# EAGLE design Prototype (EAGLE 6.5.0)
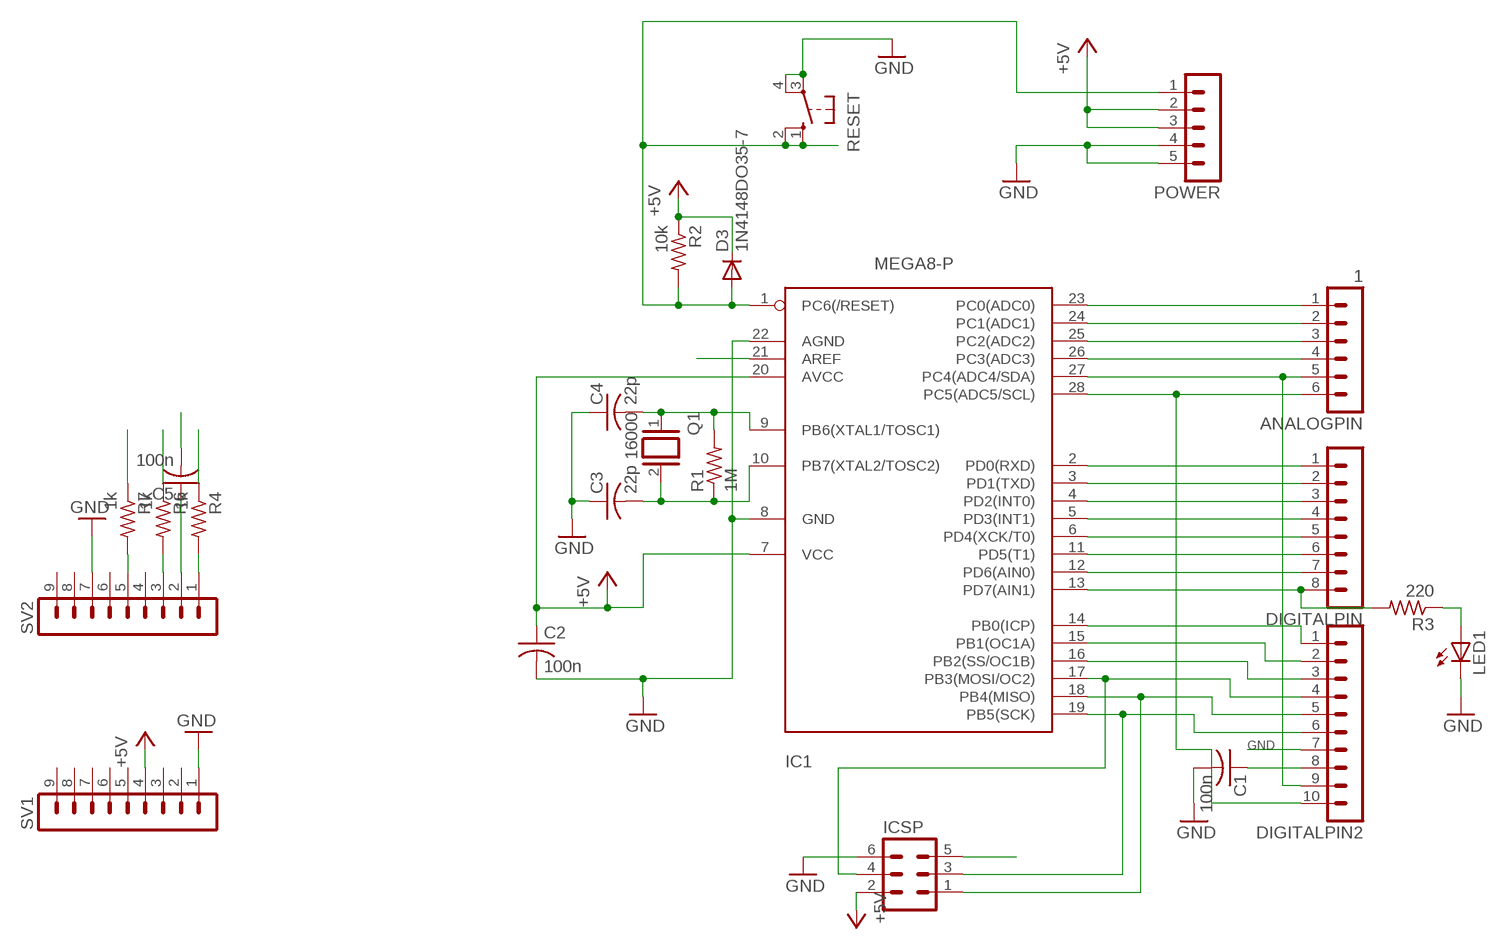
[diagram p0: schematic, sheet 1]

## Parts
ANALOGPIN  1  MA06-1  [MA06-1]
C1  100n  C-US025-024X044  [C025-024X044]
C2  100n  C-US025-024X044  [C025-024X044]
C3  22p  C-US025-024X044  [C025-024X044]
C4  22p  C-US025-024X044  [C025-024X044]
C5  100n  C-US025-024X044  [C025-024X044]
D3  1N4148DO35-7  [DO35-7]
DIGITALPIN  MA08-1  [MA08-1]
DIGITALPIN2  MA10-1  [MA10-1]
IC1  MEGA8-P  [DIL28-3]
ICSP  MA03-2  [MA03-2]
LED1  LED3MM  [LED3MM]
POWER  MA05-1  [MA05-1]
Q1  16000  XTAL/S  [QS]
R1  1M  R-US_0204/7  [0204/7]
R2  10k  R-US_0204/7  [0204/7]
R3  220  R-US_0204/7  [0204/7]
R4  1k  R-US_0204/7  [0204/7]
R6  1k  R-US_0204/7  [0204/7]
R7  1k  R-US_0204/7  [0204/7]
RESET  10-XX  [B3F-10XX]
SV1  MA09-1  [MA09-1]
SV2  MA09-1  [MA09-1]

## Nets
+5V: C2.1 D3.C IC1.7(VCC) IC1.20(AVCC) ICSP.2 POWER.2 POWER.3 R2.1 SV1.4
AREF: C1.1 DIGITALPIN2.8 IC1.21(AREF)
GND: C1.2 C2.2 C3.1 C4.1 DIGITALPIN2.7 IC1.8(GND) IC1.22(AGND) ICSP.6 LED1.K(C) POWER.4 POWER.5 RESET.3(P) RESET.4(P1) SV1.1 SV2.7
N$1: C4.2 IC1.9(PB6(XTAL1/TOSC1)) Q1.1 R1.2
N$2: C3.2 IC1.10(PB7(XTAL2/TOSC2)) Q1.2 R1.1
N$3: LED1.A R3.1
N$4: C5.1 SV2.2
N$5: R7.2 SV2.5
N$6: DIGITALPIN.3 IC1.4(PD2(INT0))
N$7: DIGITALPIN.4 IC1.5(PD3(INT1))
N$8: DIGITALPIN.5 IC1.6(PD4(XCK/T0))
N$9: DIGITALPIN.6 IC1.11(PD5(T1))
N$10: DIGITALPIN.7 IC1.12(PD6(AIN0))
N$11: DIGITALPIN.8 IC1.13(PD7(AIN1)) R3.2
N$12: ANALOGPIN.1 IC1.23(PC0(ADC0))
N$13: ANALOGPIN.2 IC1.24(PC1(ADC1))
N$14: ANALOGPIN.3 IC1.25(PC2(ADC2))
N$15: ANALOGPIN.4 IC1.26(PC3(ADC3))
N$16: ANALOGPIN.5 DIGITALPIN2.9 IC1.27(PC4(ADC4/SDA))
N$17: R4.2 SV2.1
N$18: DIGITALPIN2.1 IC1.14(PB0(ICP))
N$19: DIGITALPIN2.2 IC1.15(PB1(OC1A))
N$20: DIGITALPIN2.3 IC1.16(PB2(SS/OC1B))
N$22: DIGITALPIN2.5 IC1.18(PB4(MISO)) ICSP.1
N$23: DIGITALPIN2.6 IC1.19(PB5(SCK)) ICSP.3
N$24: R6.2 SV2.3
N$25: DIGITALPIN2.4 IC1.17(PB3(MOSI/OC2)) ICSP.4
N$27: ANALOGPIN.6 DIGITALPIN2.10 IC1.28(PC5(ADC5/SCL))
RES1: C5.2 D3.A IC1.1(PC6(/RESET)) ICSP.5 POWER.1 R2.2 R6.1 RESET.1(S) RESET.2(S1)
RXD: DIGITALPIN.1 IC1.2(PD0(RXD)) R7.1
TXD: DIGITALPIN.2 IC1.3(PD1(TXD)) R4.1
Unconnected: SV1.2 SV1.3 SV1.5 SV1.6 SV1.7 SV1.8 SV1.9 SV2.4 SV2.6 SV2.8 SV2.9

## Library data of the parts
ANALOGPIN = con-lstb:MA06-1: PIN HEADER
C1-C5 = rcl:C-US: CAPACITOR, American symbol
D3 = diode:1N4148: DIODE high speed (Philips)
DIGITALPIN = con-lstb:MA08-1: PIN HEADER
DIGITALPIN2 = con-lstb:MA10-1: PIN HEADER
IC1 = atmel:MEGA8-P: MICROCONTROLLER 8 Kbytes FLASH, 1 kbytes SRAM, 512 bytes EEPROM, USART, 4-channel 10 bit ADC, 2-channel 8 bit ADC Pin compatible with Atmega48, ATMega88, ATMega168 Source: avr.lbr
ICSP = con-lstb:MA03-2: PIN HEADER
LED1 = led:LED: LED OSRAM: - CHIPLED LG R971, LG N971, LY N971, LG Q971, LY Q971, LO R971, LY R971 LH N974, LH R974 LS Q976, LO Q976, LY Q976 LO Q996 - Hyper CHIPLED LW Q18S LB Q993, LB Q99A, LB R99A - SideLED LS A670, LO A670, LY A670, LG A670, LP A670 LB A673, LV A673, LT A673, LW A673 LH A674 LY A675 LS A676, LA A676, LO A676, LY A676, LW A676 LS A679, LY A679, LG A679 - Hyper Micro SIDELED® LS Y876, LA Y876, LO Y876, LY Y876 LT Y87S - SmartLED LW L88C, LW L88S LB L89C, LB L89S, LG L890 LS L89K, LO L89K, LY L89K LS L896, LA L896, LO L896, LY L896 - TOPLED LS T670, LO T670, LY T670, LG T670, LP T670 LSG T670, LSP T670, LSY T670, LOP T670, LYG T670 LG T671, LOG T671, LSG T671 LB T673, LV T673, LT T673, LW T673 LH T674 LS T676, LA T676, LO T676, LY T676, LB T676, LH T676, LSB T676, LW T676 LB T67C, LV T67C, LT T67C, LS T67K, LO T67K, LY T67K, LW E67C LS E67B, LA E67B, LO E67B, LY E67B, LB E67C, LV E67C, LT E67C LW T67C LS T679, LY T679, LG T679 LS T770, LO T770, LY T770, LG T770, LP T770 LB T773, LV T773, LT T773, LW T773 LH T774 LS E675, LA E675, LY E675, LS T675 LS T776, LA T776, LO T776, LY T776, LB T776 LHGB T686 LT T68C, LB T68C - Hyper Mini TOPLED® LB M676 - Mini TOPLED Santana® LG M470 LS M47K, LO M47K, LY M47K Source: http://www.osram.convergy.de LUXEON: - LUMILED® LXK2-PW12-R00, LXK2-PW12-S00, LXK2-PW14-U00, LXK2-PW14-V00 LXK2-PM12-R00, LXK2-PM12-S00, LXK2-PM14-U00 LXK2-PE12-Q00, LXK2-PE12-R00, LXK2-PE12-S00, LXK2-PE14-T00, LXK2-PE14-U00 LXK2-PB12-K00, LXK2-PB12-L00, LXK2-PB12-M00, LXK2-PB14-N00, LXK2-PB14-P00, LXK2-PB14-Q00 LXK2-PR12-L00, LXK2-PR12-M00, LXK2-PR14-Q00, LXK2-PR14-R00 LXK2-PD12-Q00, LXK2-PD12-R00, LXK2-PD12-S00 LXK2-PH12-R00, LXK2-PH12-S00 LXK2-PL12-P00, LXK2-PL12-Q00, LXK2-PL12-R00 Source: www.luxeon.com KINGBRIGHT: KA-3528ASYC Source: www.kingbright.com
POWER = con-lstb:MA05-1: PIN HEADER
Q1 = special:XTAL/S: CRYSTAL
R1-R4 R6 R7 = rcl:R-US_: RESISTOR, American symbol
RESET = switch-omron:10-XX: OMRON SWITCH
SV1 SV2 = con-lstb:MA09-1: PIN HEADER

## Board
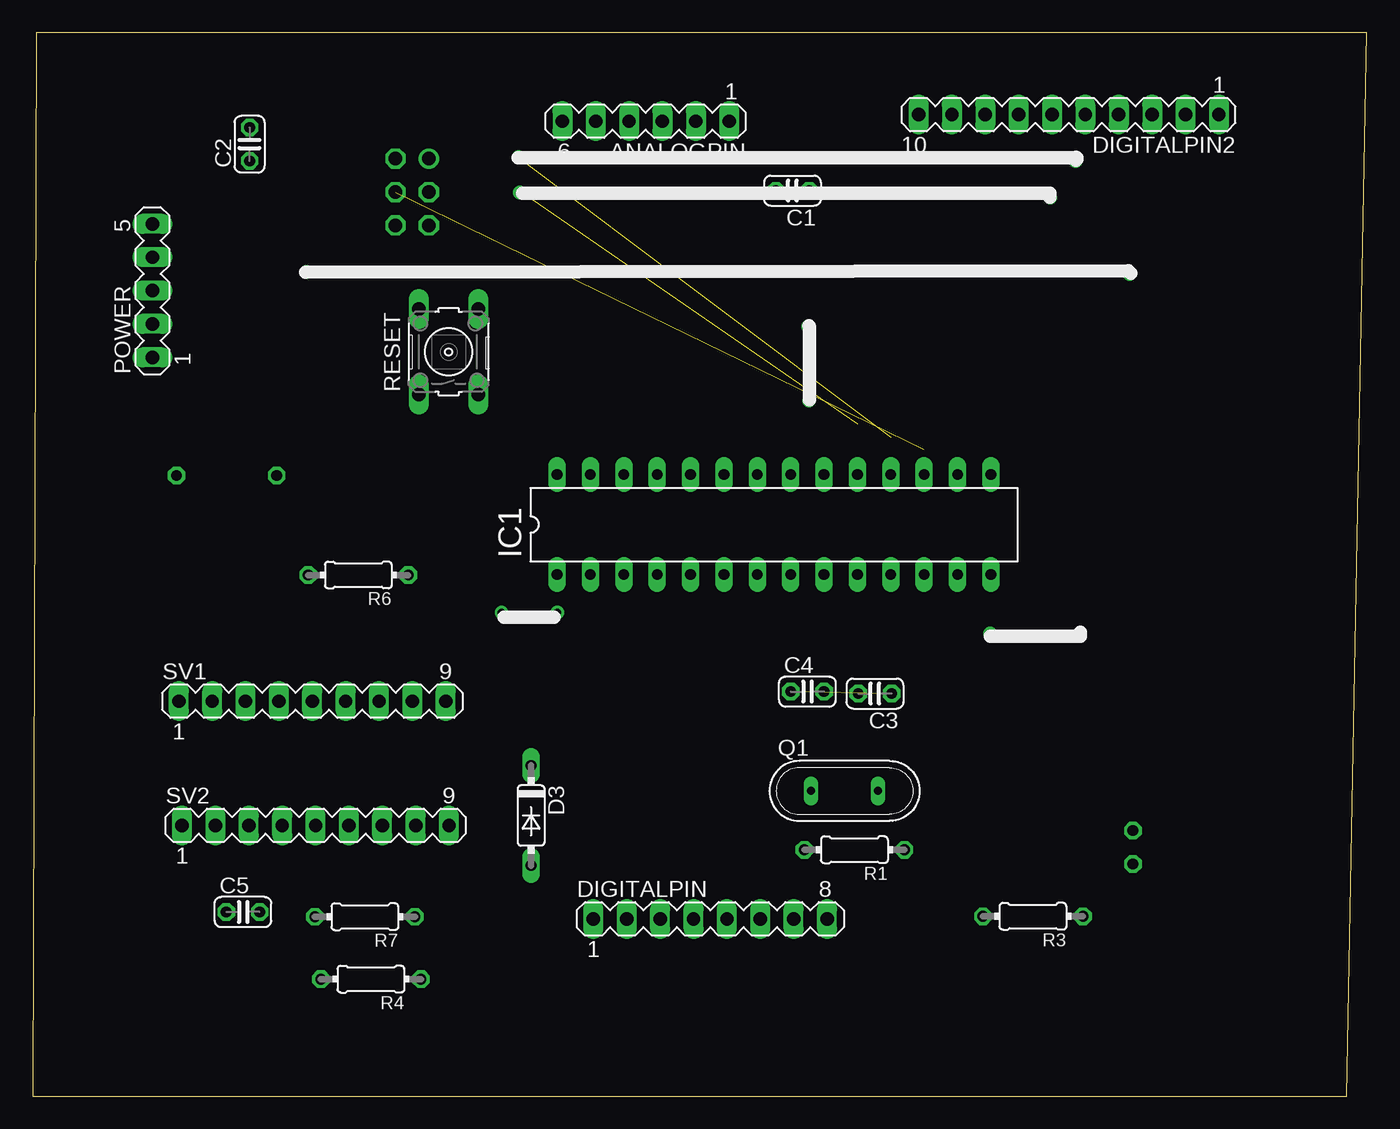
[diagram p1: board, top side]
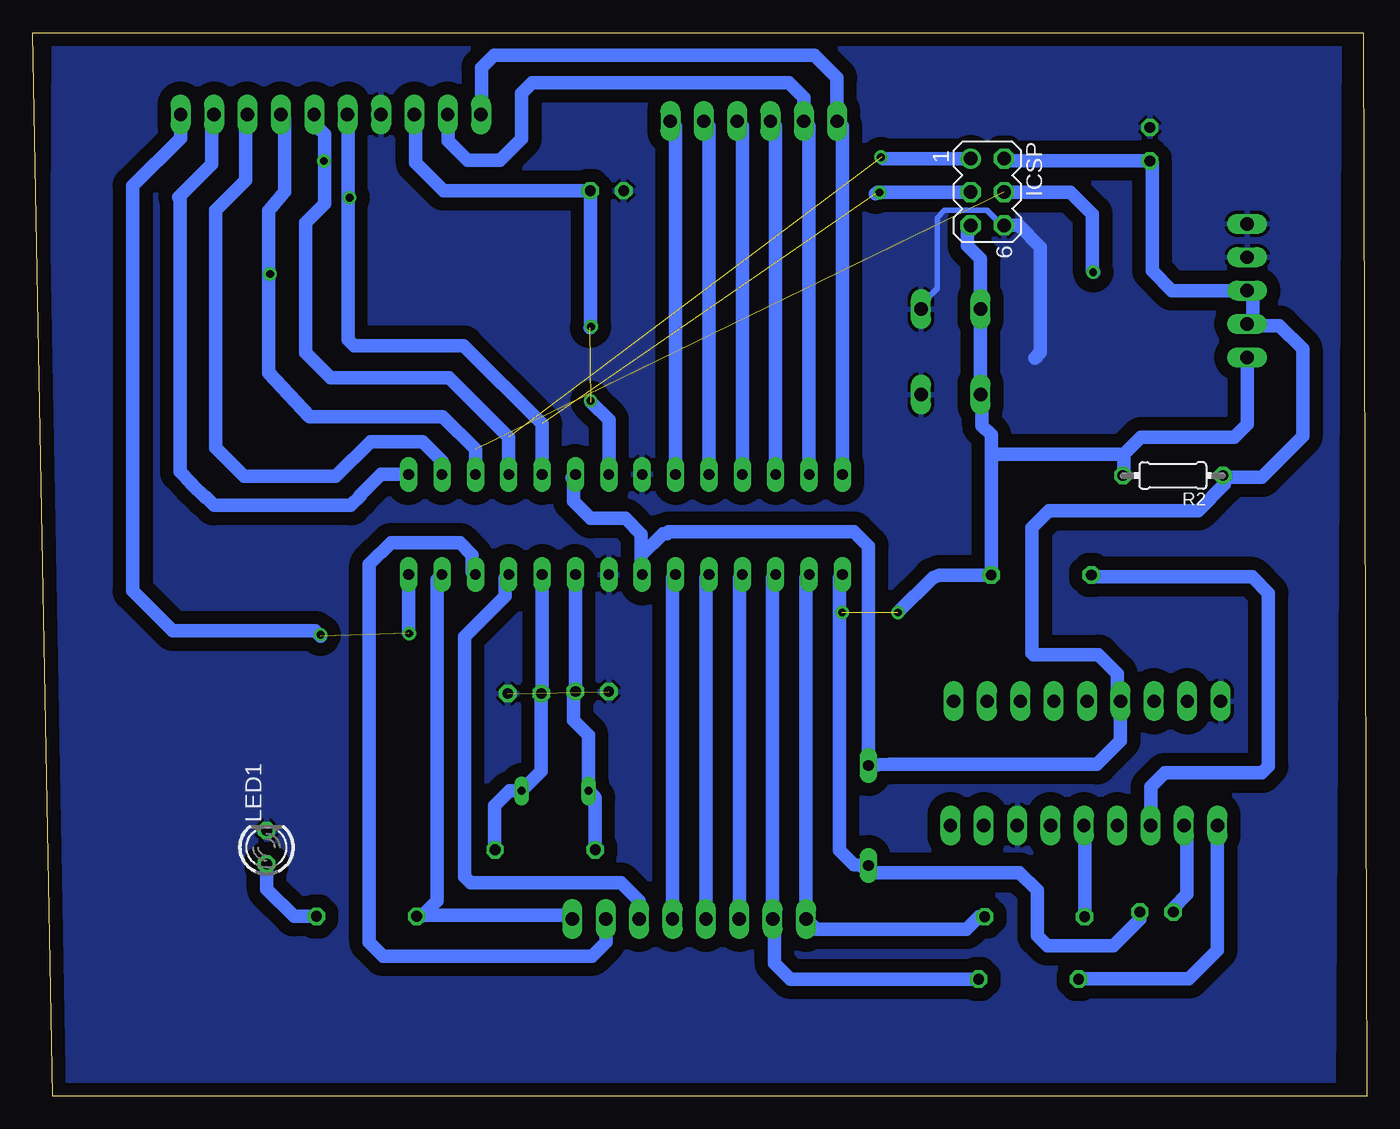
[diagram p2: board, bottom side, seen from below]

Size 101.52 x 80.9 mm. Coordinates in mm from the lower left corner, seen from the top.
Outline: 0,0 100,0 101.52,80.9 0.25,80.9 0,0
Copper layers (1*16): Top 0.035mm / dielectric 1.5mm / Bottom 0.035mm
Design rules "default *": minimum track width 10mil, minimum drill 24mil, track to track 40mil, track to pad 40mil, pad to pad 40mil, via to via 40mil, smd to smd 8mil, copper to edge 40mil, drill to drill 8mil, minimum pad ring 10mil, minimum via ring 8mil, stop-mask expansion 4mil, vias tented up to drill 0mil, thermal gap 10mil

### Footprints (pad centres in the part's own frame; a part is rotated, then mirrored left to right if it is on the bottom)
MA06-1 = drill 1.016 long: 1 -6.35,0; 2 -3.81,0; 3 -1.27,0; 4 1.27,0; 5 3.81,0; 6 6.35,0
C025-024X044 = drill 0.813 octagon: 1 -1.27,0; 2 1.27,0
DO35-7 = drill 0.813 long: A 3.81,0; C -3.81,0
MA08-1 = drill 1.016 long: 1 -8.89,0; 2 -6.35,0; 3 -3.81,0; 4 -1.27,0; 5 1.27,0; 6 3.81,0; 7 6.35,0; 8 8.89,0
MA10-1 = drill 1.016 long: 1 -11.43,0; 2 -8.89,0; 3 -6.35,0; 4 -3.81,0; 5 -1.27,0; 6 1.27,0; 7 3.81,0; 8 6.35,0; 9 8.89,0; 10 11.43,0
DIL28-3 = drill 0.813 long: 1 -16.51,-3.81; 2 -13.97,-3.81; 3 -11.43,-3.81; 4 -8.89,-3.81; 5 -6.35,-3.81; 6 -3.81,-3.81; 7 -1.27,-3.81; 8 1.27,-3.81; 9 3.81,-3.81; 10 6.35,-3.81; 11 8.89,-3.81; 12 11.43,-3.81; 13 13.97,-3.81; 14 16.51,-3.81; 15 16.51,3.81; 16 13.97,3.81; 17 11.43,3.81; 18 8.89,3.81; 19 6.35,3.81; 20 3.81,3.81; 21 1.27,3.81; 22 -1.27,3.81; 23 -3.81,3.81; 24 -6.35,3.81; 25 -8.89,3.81; 26 -11.43,3.81; 27 -13.97,3.81; 28 -16.51,3.81
MA03-2 = drill 1.016: 1 -2.54,-1.27 | drill 1.016 octagon: 2 -2.54,1.27; 3 0,-1.27; 4 0,1.27; 5 2.54,-1.27; 6 2.54,1.27
LED3MM = drill 0.813 octagon: A -1.27,0; K 1.27,0
MA05-1 = drill 1.016 long: 1 -5.08,0; 2 -2.54,0; 3 0,0; 4 2.54,0; 5 5.08,0
QS = drill 0.61 long: 1 -2.54,0; 2 2.54,0
0204/7 = drill 0.813 octagon: 1 -3.81,0; 2 3.81,0
B3F-10XX = drill 1.016 long: 1 -3.251,2.261; 2 3.251,2.261; 3 -3.251,-2.261; 4 3.251,-2.261
MA09-1 = drill 1.016 long: 1 -10.16,0; 2 -7.62,0; 3 -5.08,0; 4 -2.54,0; 5 0,0; 6 2.54,0; 7 5.08,0; 8 7.62,0; 9 10.16,0

### Placement (x,y rotation side)
ANALOGPIN  46.65,74.18 180 top
C1  57.82,68.89 180 top
C2  16.5,72.43 90 top
C3  64.1,30.63 180 top
C4  58.95,30.78 0 top
C5  15.99,14.01 0 top
D3  37.92,21.35 270 top
DIGITALPIN  51.56,13.49 0 top
DIGITALPIN2  78.84,74.68 180 top
IC1  56.41,43.49 0 top
ICSP  28.87,68.79 270 bottom
LED1  83.73,18.93 90 bottom
POWER  9.09,61.29 90 top
Q1  61.78,23.22 0 top
R1  62.53,18.74 180 top
R2  14.75,47.22 180 bottom
R3  76.12,13.68 180 top
R4  25.73,8.9 180 top
R6  24.77,39.65 180 top
R7  25.27,13.65 180 top
RESET  31.65,56.63 90 top
SV1  21.27,30.05 0 top
SV2  21.52,20.6 0 top

### Tracks (layer width: path | path; a pad name or v marks a point on that pad's centre or on a via)
+5V
  Bottom 1.016: 8.66,58.62 POWER.2 | 8.66,58.62 8.66,61.02 POWER.3 14.81,61.29 16.32,62.8 16.32,70.98 C2.1 27.43,71.16 ICSP.2 | 55.22,41.15 53.57,42.8 53.27,42.8 53.12,42.95 39.02,42.95 37.92,41.85 D3.C 36.33,25.25 20.52,25.25 18.73,27.04 SV1.4 18.97,30.29 18.97,32.15 20.42,33.6 25.37,33.6 25.47,33.7 25.47,43.25 24.17,44.55 12.82,44.55 10.82,46.55 10.82,47.1 | 55.22,41.15 55.22,39.76 IC1.7 | 60.47,47.05 IC1.20 60.37,47.15 60.37,45.25 59.07,43.95 56.42,43.95 55.22,42.75 55.22,41.15 | 8.66,58.62 6.64,58.62 4.87,56.85 4.87,50.2 7.97,47.1 10.82,47.1 | 10.82,47.1 R2.1
AREF  (1 unrouted)
  Bottom 1.016: DIGITALPIN2.8 72.37,74.56 72.37,71 70.26,68.89 C1.1 59.09,58.48 59.12,58.45 | IC1.21 57.68,51.46 59.02,52.8
GND  (1 unrouted)
  Bottom 0.406: ICSP.6 27.77,66.25 28.92,67.4 32.12,67.4 32.67,66.85 32.67,61.45 34.07,60.05
  Bottom 1.016: ICSP.6 26.47,66.25 24.82,64.6 24.82,56.6 25.27,56.15
  pour Bottom: 2.09,80.46 99.88,80.46 100.33,0 2.54,0
N$1
  Bottom 1.016: R1.2 58.72,22.7 Q1.1 59.24,27.47 60.37,28.6 60.37,30.63 C4.2 IC1.9
N$2
  Bottom 1.016: IC1.10 62.76,30.7 C3.2 62.83,24.71 Q1.2 65.25,23.22 66.37,22.1 66.37,18.77 R1.1
N$3
  Bottom 1.016: R3.1 81.65,13.68 83.72,15.75 LED1.A
N$4
  Bottom 1.016: C5.1 14.72,14.3 13.67,15.35 13.67,20.37 SV2.2
N$5
  Bottom 1.016: R7.2 21.46,20.54 SV2.5
N$6
  Bottom 1.016: DIGITALPIN.3 47.75,39.45 IC1.4
N$7
  Bottom 1.016: DIGITALPIN.4 50.29,39.45 IC1.5
N$8
  Bottom 1.016: DIGITALPIN.5 52.83,39.45 IC1.6
N$9
  Bottom 1.016: DIGITALPIN.6 55.37,14.85 56.77,16.25 68.22,16.25 68.67,16.7 68.67,34.95 65.57,38.05 65.57,39.41 IC1.11
N$10
  Bottom 1.016: DIGITALPIN.7 57.91,11.71 58.97,10.65 74.87,10.65 75.92,11.7 75.92,40.45 74.27,42.1 69.02,42.1 68.07,41.15 68.07,39.91 IC1.12
N$11
  Bottom 1.016: DIGITALPIN.8 60.47,13.5 60.47,13.75 72.24,13.75 R3.2 71.94,13.68 70.77,14.85 70.77,39.29 IC1.13
N$12
  Bottom 1.016: IC1.23 52.6,73.78 ANALOGPIN.1
N$13
  Bottom 1.016: IC1.24 50.06,73.78 ANALOGPIN.2
N$14
  Bottom 1.016: IC1.25 47.52,73.78 ANALOGPIN.3
N$15
  Bottom 1.016: IC1.26 44.98,73.78 ANALOGPIN.4
N$16
  Bottom 1.016: IC1.27 42.44,73.78 ANALOGPIN.5 42.84,75.97 43.97,77.1 63.52,77.1 64.32,76.3 64.32,72.85 65.97,71.2 68.42,71.2 69.92,72.7 69.92,73.9 69.97,73.95 69.97,74.66 DIGITALPIN2.9
N$17
  Bottom 1.016: SV2.1 11.36,11.11 13.52,8.95 21.87,8.95 R4.2
N$18  (via drill 0.6)  (2 unrouted)
  Bottom 1.016: 72.92,35.2 IC1.14 | DIGITALPIN2.1 90.27,72.9 93.92,69.25 93.92,38.45 90.87,35.4 80.02,35.4 79.62,35
  other vias: 72.87,35.2
N$19
  Bottom 0.254: 72.39,46.99 IC1.15
  Bottom 1.016: DIGITALPIN2.2 87.92,74.49 87.92,70.9 90.42,68.4 90.32,68.3 90.32,47.5 89.42,46.6 89.42,46.55 88.42,45.55 88.32,45.55 87.72,44.95 77.32,44.95 76.62,45.65 76.62,45.7 75.02,47.3 IC1.15
N$20
  Bottom 1.016: IC1.16 70.38,48.31 71.87,49.8 75.82,49.8 78.47,47.15 85.42,47.15 87.62,49.35 87.62,67.4 85.32,69.7 85.32,74.55 DIGITALPIN2.3
N$21  (via drill 0.6)
  other vias: 79.62,35.1
N$22  (1 unrouted)
  Bottom 1.016: IC1.18 65.3,50.13 69.82,54.65 78.87,54.65 80.77,56.55 80.77,66.45 79.32,67.9 79.32,73.2 80.22,74.1 80.22,74.57 DIGITALPIN2.5 | ICSP.1 36.8,71.33 36.92,71.45
N$23  (1 unrouted)
  Bottom 1.016: IC1.19 62.76,51.14 68.72,57.1 77.07,57.1 77.52,57.55 77.52,74.63 DIGITALPIN2.6 | ICSP.3 37.23,68.79 37.37,68.65
N$24
  Bottom 1.016: SV2.3 16.44,23.53 15.37,24.6 7.97,24.6 7.47,25.1 7.47,38.25 8.72,39.5 20.81,39.5 R6.2
N$25  (1 unrouted)
  Bottom 1.016: IC1.17 67.84,49.22 70.32,51.7 80.47,51.7 83.57,55.05 83.57,67.35 82.37,68.8 82.37,74.4 DIGITALPIN2.4 | ICSP.4 22.56,68.79 20.87,67.1 20.87,62.8 20.77,62.7
N$27
  Bottom 1.016: IC1.28 39.9,73.78 ANALOGPIN.6 40.3,77.48 42.02,79.2 66.42,79.2 67.37,78.25 67.37,74.72 DIGITALPIN2.10
N$29  (via drill 0.6)
  other vias: 79.37,71.15
N$30  (via drill 0.6)
  other vias: 77.42,68.35
N$31  (via drill 0.6)
  other vias: 36.97,71.45
N$32  (via drill 0.6)
  other vias: 37.07,68.75
N$33  (via drill 0.6)
  other vias: 83.47,62.55
N$34  (via drill 0.6)
  other vias: 20.82,62.7
N$36  (via drill 0.6)
  other vias: 59.07,52.9
N$37  (via drill 0.6)
  other vias: 59.02,58.55
RES1  (via drill 0.6)  (1 unrouted)
  Bottom 1.016: D3.A 38.47,17.57 | 38.47,17.57 39.01,17.59 40.12,18.7 40.12,36.8 | 40.12,36.8 40.12,39.46 IC1.1 | v35.67,36.8 33.02,39.45 32.52,39.65 R6.1 28.58,48.45 | v39.92,36.8 40.12,36.8 | C5.2 17.26,13.46 19.27,11.45 24.32,11.45 25.07,12.2 25.07,15.65 26.42,17 37.9,17 38.47,17.57 | POWER.1 9.09,51.13 10.07,50.15 17.17,50.15 18.47,48.85 | 18.47,48.85 18.47,47.31 R2.2 | ICSP.5 30.37,66.02 30.37,64.7 29.39,63.72 RESET.2 RESET.1 29.27,53.26 29.27,51 28.58,50.31 28.58,48.45 | 18.47,48.85 28.18,48.85 28.58,48.45
RXD
  Bottom 1.016: 42.08,12.9 DIGITALPIN.1 | DIGITALPIN.1 42.67,39.45 IC1.2 | R7.1 29.52,13.65 30.47,12.7 41.88,12.7 DIGITALPIN.1
TXD
  Bottom 1.016: R4.1 43.87,8.9 45.07,10.1 45.07,13.35 DIGITALPIN.2 45.21,39.45 IC1.3